# EAGLE design PowerDistributorX30V2 (EAGLE 9.6.2)
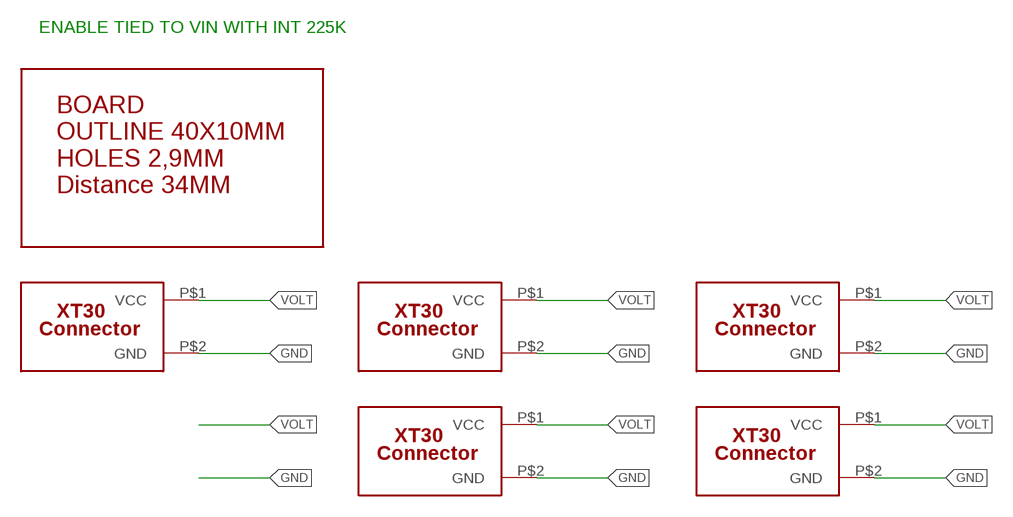
[diagram p0: schematic, sheet 1]

## Parts
U$1  BOARD40X10  [BOARD_40X10-34HOLES]
U$2  XT30  [XT30-VERT]
U$4  XT30  [XT30-VERT]
U$5  XT30  [XT30-VERT]
U$6  XT30  [XT30-VERT]
U$7  XT30  [XT30-VERT]

## Nets
GND: U$2.P$2(GND) U$4.P$2(GND) U$5.P$2(GND) U$6.P$2(GND) U$7.P$2(GND)
VOLT: U$2.P$1(VCC) U$4.P$1(VCC) U$5.P$1(VCC) U$6.P$1(VCC) U$7.P$1(VCC)

## Notes on the sheet
- ENABLE TIED TO VIN WITH INT 225K

## Library data of the parts
U$1 = MyBreadBoards:BOARD40X10
U$2 U$4-U$7 = MyBreadBoards:XT30

## Board
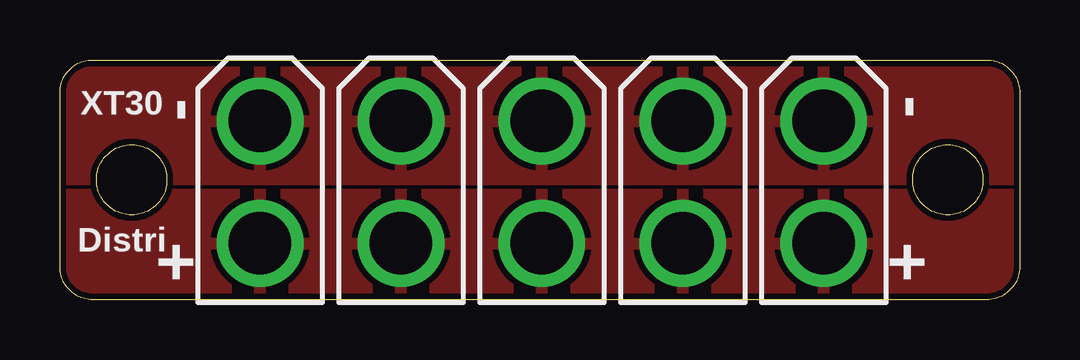
[diagram p1: board, top side]
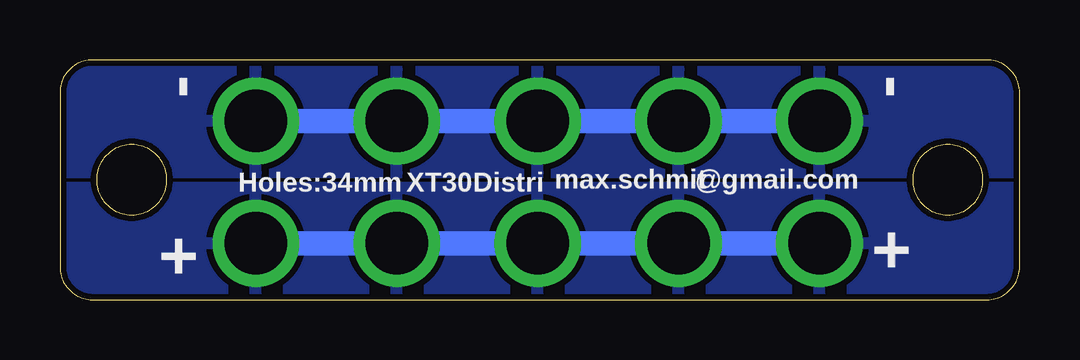
[diagram p2: board, bottom side, seen from below]

Size 40 x 10 mm. Coordinates in mm from the lower left corner, seen from the top.
Copper layers (1*16): Top 0.035mm / dielectric 1.5mm / Bottom 0.035mm
Design rules "dirt_cheap_dirty_boards.v1.1": minimum track width 6mil, minimum drill 12mil, track to track 6mil, track to pad 6mil, pad to pad 6mil, via to via 6mil, smd to smd 0mil, copper to edge 10mil, drill to drill 10mil, minimum pad ring 10mil, minimum via ring 6mil, stop-mask expansion 2mil, vias tented up to drill 25mil, thermal gap 10mil

### Footprints (pad centres in the part's own frame; a part is rotated, then mirrored left to right if it is on the bottom)
XT30-VERT = drill 2.6: P$1 0.127,7.771; P$2 0.127,2.667

### Placement (x,y rotation side)
U$1  0.34,0.34 0 top
U$2  26.09,10.12 180 top
U$4  8.47,10.12 180 top
U$5  20.21,10.12 180 top
U$6  14.34,10.12 180 top
U$7  31.96,10.12 180 top

### Tracks (layer width: path | path; a pad name or v marks a point on that pad's centre or on a via)
GND
  Bottom 1.016: U$7.P$2 U$4.P$2
  Bottom 1.27: U$6.P$2 14.28,7.52
  pour Top: -1.69,10.63 -1.69,3.59 -0.25,5.04 43.52,5.04 43.52,10.63 39.96,14.18 1.86,14.18
  pour Bottom (rank 2): -2.2,10.78 -2.2,5.04 -2.58,4.66 41.23,4.66 43.01,6.44 43.01,10.78
VOLT
  Bottom 1.016: U$4.P$1 U$7.P$1
  Bottom 1.27: U$4.P$1 8.47,2.32
  pour Bottom: -1.69,4.68 -1.69,-1.06 -2.07,-1.44 41.74,-1.44 43.52,0.34 43.52,4.68
  pour Top (rank 2): -1.95,3.51 -1.95,-3.52 -0.5,-2.07 43.26,-2.07 43.26,3.51 42.25,4.53 -0.93,4.53

### Text on the board
tPlace: XT30 | - | - | Distri | + | +
bPlace: - | - | @gmail.com | max.schmit | XT30Distri | Holes:34mm | + | +